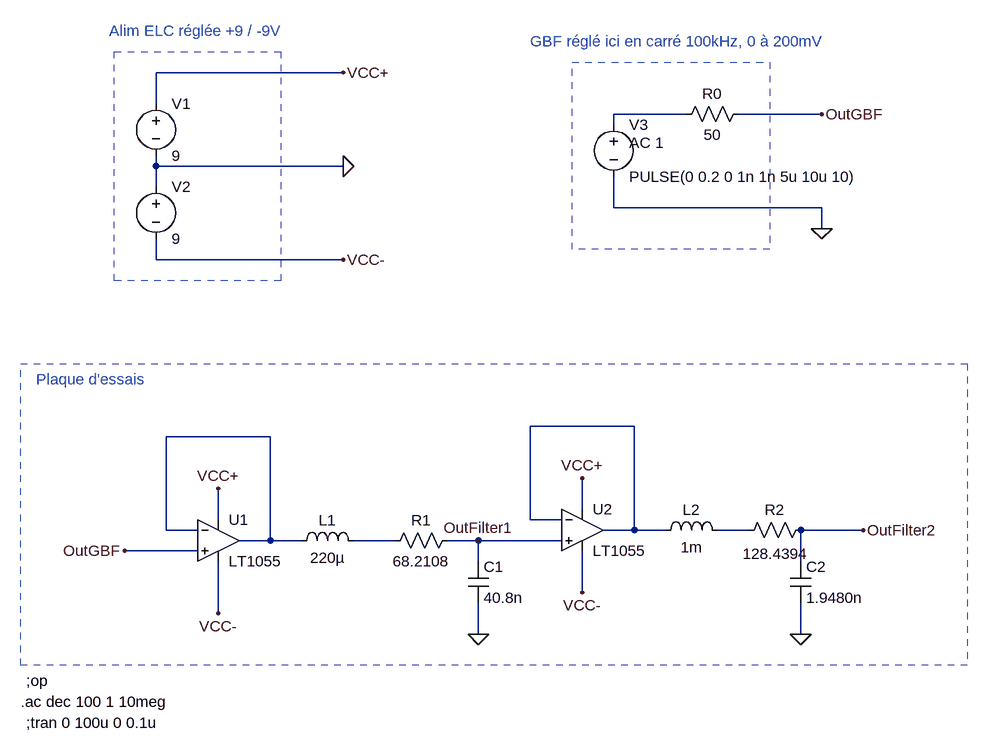
[diagram p0: schematic Draft1.asc]
Draft1.asc, the LTspice schematic file:
Version 4
SHEET 1 1092 680
WIRE 128 -896 -160 -896
WIRE -160 -848 -160 -896
WIRE 656 -832 544 -832
WIRE 864 -832 736 -832
WIRE 544 -816 544 -832
WIRE -160 -752 -160 -768
WIRE 128 -752 -160 -752
WIRE -160 -720 -160 -752
WIRE 544 -688 544 -736
WIRE 864 -688 544 -688
WIRE 864 -656 864 -688
WIRE -160 -608 -160 -640
WIRE 128 -608 -160 -608
WIRE 576 -352 416 -352
WIRE 16 -336 -144 -336
WIRE 496 -224 496 -272
WIRE -64 -208 -64 -256
WIRE 416 -208 416 -352
WIRE 464 -208 416 -208
WIRE -144 -192 -144 -336
WIRE -96 -192 -144 -192
WIRE 576 -192 576 -352
WIRE 576 -192 528 -192
WIRE 624 -192 576 -192
WIRE 752 -192 704 -192
WIRE 928 -192 832 -192
WIRE 16 -176 16 -336
WIRE 16 -176 -32 -176
WIRE 64 -176 16 -176
WIRE 208 -176 144 -176
WIRE 336 -176 288 -176
WIRE 464 -176 336 -176
WIRE -96 -160 -208 -160
WIRE 336 -144 336 -176
WIRE 832 -144 832 -192
WIRE 496 -96 496 -160
WIRE -64 -64 -64 -144
WIRE 336 -32 336 -80
WIRE 832 -32 832 -80
FLAG 336 -32 0
FLAG 832 -32 0
FLAG -64 -256 VCC+
FLAG -64 -64 VCC-
FLAG -208 -160 OutGBF
FLAG 336 -176 OutFilter1
FLAG 496 -272 VCC+
FLAG 496 -96 VCC-
FLAG 928 -192 OutFilter2
FLAG 128 -752 0
FLAG 864 -656 0
FLAG 128 -896 VCC+
FLAG 128 -608 VCC-
FLAG 864 -832 OutGBF
SYMBOL res 304 -192 R90
WINDOW 0 0 56 VBottom 2
WINDOW 3 32 56 VTop 2
SYMATTR InstName R1
SYMATTR Value 68.2108
SYMBOL ind 48 -160 R270
WINDOW 0 32 56 VTop 2
WINDOW 3 5 56 VBottom 2
SYMATTR InstName L1
SYMATTR Value 220µ
SYMBOL cap 320 -144 R0
SYMATTR InstName C1
SYMATTR Value 40.8n
SYMBOL OpAmps\\LT1055 -64 -240 R0
SYMATTR InstName U1
SYMBOL OpAmps\\LT1055 496 -256 R0
SYMATTR InstName U2
SYMBOL res 848 -208 R90
WINDOW 0 0 56 VBottom 2
WINDOW 3 37 55 VTop 2
SYMATTR InstName R2
SYMATTR Value 128.4394
SYMBOL cap 816 -144 R0
SYMATTR InstName C2
SYMATTR Value 1.9480n
SYMBOL ind 608 -176 R270
WINDOW 0 32 56 VTop 2
WINDOW 3 5 56 VBottom 2
SYMATTR InstName L2
SYMATTR Value 1m
SYMBOL voltage -160 -864 R0
WINDOW 123 0 0 Left 2
WINDOW 39 0 0 Left 2
SYMATTR InstName V1
SYMATTR Value 9
SYMBOL voltage -160 -736 R0
WINDOW 123 0 0 Left 2
WINDOW 39 0 0 Left 2
SYMATTR InstName V2
SYMATTR Value 9
SYMBOL voltage 544 -832 R0
WINDOW 123 24 44 Left 2
WINDOW 39 0 0 Left 2
SYMATTR Value2 AC 1
SYMATTR InstName V3
SYMATTR Value PULSE(0 0.2 0 1n 1n 5u 10u 10)
SYMBOL res 752 -848 R90
WINDOW 0 0 56 VBottom 2
WINDOW 3 32 56 VTop 2
SYMATTR InstName R0
SYMATTR Value 50
TEXT -344 -424 Left 2 ;Plaque d'essais
TEXT -232 -960 Left 2 ;Alim ELC réglée +9 / -9V
TEXT 416 -944 Left 2 ;GBF réglé ici en carré 100kHz, 0 à 200mV
TEXT -368 72 Left 2 !.ac dec 100 1 10meg
TEXT -360 40 Left 2 !;op
TEXT -360 104 Left 2 !;tran 0 100u 0 0.1u
RECTANGLE Normal 1088 16 -368 -448 2
RECTANGLE Normal 32 -576 -224 -928 2
RECTANGLE Normal 784 -624 480 -912 2

The netlist it stands for:
* Draft1.asc
R1 OutFilter1 N005 68.2108
L1 N003 N005 220µ
C1 OutFilter1 0 40.8n
XU1 OutGBF N003 VCC+ VCC- N003 LT1055  ; pins In+ In- V+ V- OUT
XU2 OutFilter1 N002 VCC+ VCC- N002 LT1055  ; pins In+ In- V+ V- OUT
R2 OutFilter2 N004 128.4394
C2 OutFilter2 0 1.9480n
L2 N002 N004 1m
V1 VCC+ 0 9
V2 0 VCC- 9
V3 N001 0 PULSE(0 0.2 0 1n 1n 5u 10u 10) AC 1
R0 OutGBF N001 50
* Plaque d'essais
* Alim ELC réglée +9 / -9V
* GBF réglé ici en carré 100kHz, 0 à 200mV
.ac dec 100 1 10meg
;op
;tran 0 100u 0 0.1u
.backanno
.end

* Results of the author's LTspice run, read from the files saved beside the schematic
* Operating Point, zero values left out:
*   V(vcc+) = 9 V
*   V(vcc-) = -9 V
*   I(V2) = -5.6 mA
*   I(V1) = -5.6 mA
*   Ix(u1:3) = 2.8 mA
*   Ix(u1:4) = -2.8 mA
*   Ix(u2:3) = 2.8 mA
*   Ix(u2:4) = -2.8 mA
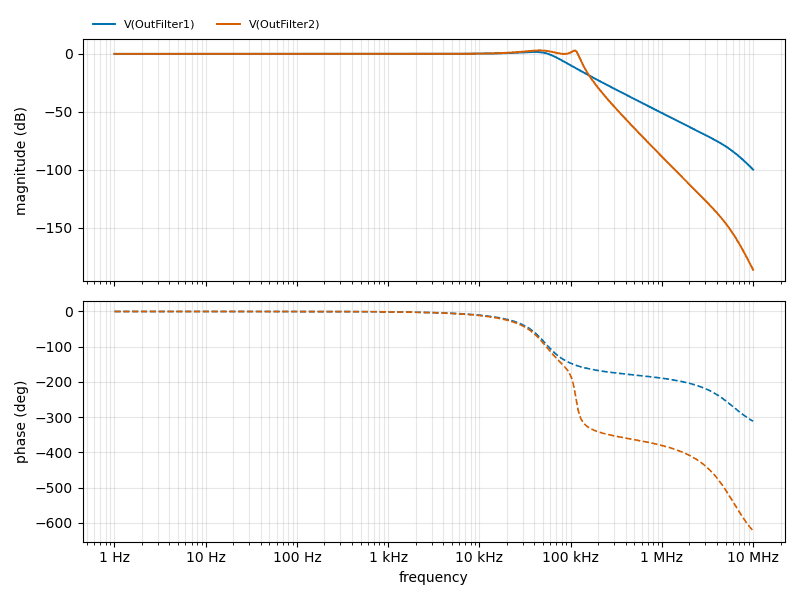
[diagram p1: AC Analysis of Draft1.asc, plotted from the saved traces]
* AC Analysis, 1 run:
*   V(OutFilter1): -0.00 dB at 1 Hz, -99.67 dB at 10 MHz, peak 1.71 dB at 39.81 kHz, 3 dB below the peak at 62.53 kHz
*   V(OutFilter2): -0.00 dB at 1 Hz, -186.06 dB at 10 MHz, peak 3.01 dB at 45.71 kHz, 3 dB below the peak at 524.6 Hz and 82.77 kHz